# EAGLE design mcu_battery (EAGLE 9.5.2)
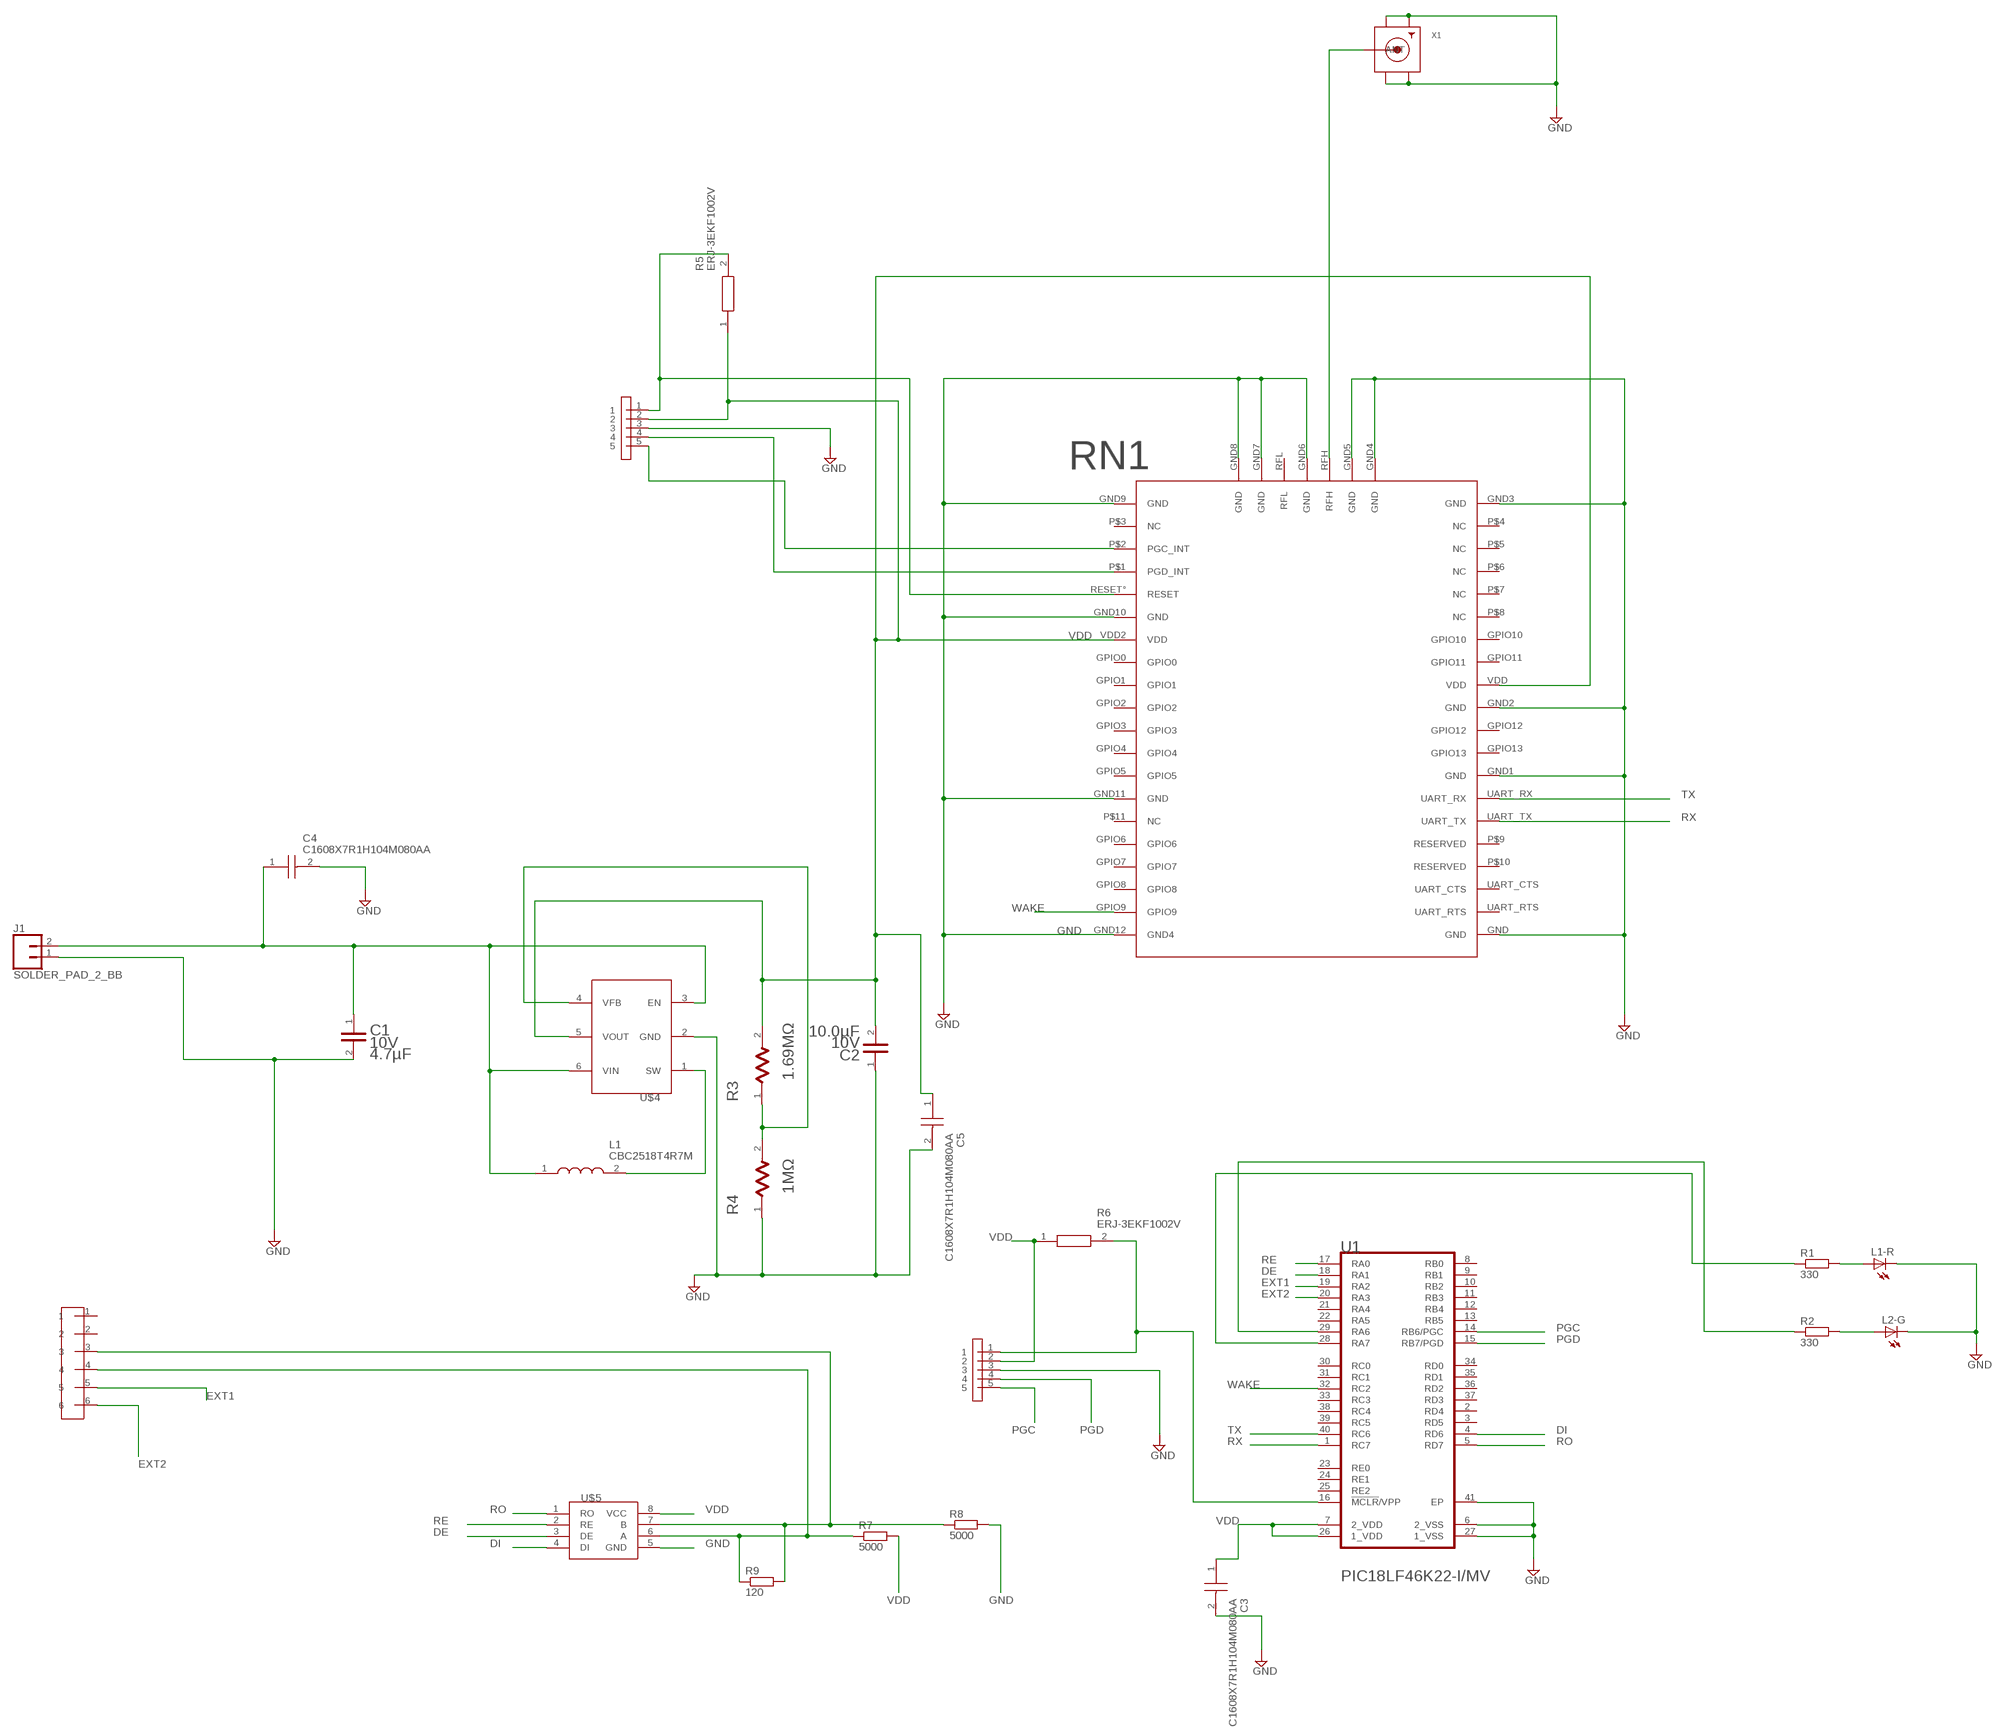
[diagram p0: schematic, sheet 1]

## Parts
C1  KEMET_C0603C475K8PACTUKEMET_C0603C475K8PACTU_0_0  [KEMET_C0603C475K8PACTU_0]
C2  TDK_C1608X5R1A106M080ACTDK_C1608X5R1A106M080AC_0_0  [TDK_C1608X5R1A106M080AC_0]
C3  C1608X7R1H104M080AA  [CAPC1608X80N]
C4  C1608X7R1H104M080AA  [CAPC1608X80N]
C5  C1608X7R1H104M080AA  [CAPC1608X80N]
J1  SOLDER_PAD_2_BB  [SOLDER_PAD_2]
L1  CBC2518T4R7M  [INDC2518X200N]
L1-R  LEDCHIP-LED0603  [CHIP-LED0603]
L2-G  LEDCHIP-LED0603  [CHIP-LED0603]
R1  330  R-EU_R0603  [R0603]
R2  330  R-EU_R0603  [R0603]
R3  VISHAY_CRCW06031M69FKEAVISHAY_CRCW06031M69FKEA_0_1  [VISHAY_CRCW06031M69FKEA_1]
R4  STACKPOLE_RMCF0603FT1M00STACKPOLE_RMCF0603FT1M00_0_1  [STACKPOLE_RMCF0603FT1M00_1]
R5  ERJ-3EKF1002V  [RESC1608X55N]
R6  ERJ-3EKF1002V  [RESC1608X55N]
R7  5000  R-EU_R0805  [R0805]
R8  5000  R-EU_R0805  [R0805]
R9  120  R-EU_R0805  [R0805]
RN1  NEW_RN2483  [NEW_RN2483]
U1  MICROCHIP_PIC18LF46K22-I-MVMICROCHIP_PIC18LF46K22-I-MV_0_1  [MICROCHIP_PIC18LF46K22-I-MV_1]
U$1  CONNECTOR62  [CONNECTOR6]
U$2  ICSP52  [ICSP]
U$3  ICSP52  [ICSP]
U$4  MCP16252  [MCP16252]
U$5  AMD3485E  [AMD3485E]
X1  SMACONNECTOR_EDGE  [SMA_EDGELAUNCH]

## Nets
DE: U1.18(RA1) U$5.3(DE)
DI: U1.4(RD6) U$5.4(DI)
EXT1: U1.19(RA2) U$1.5
EXT2: U1.20(RA3) U$1.6
GND: C1.2 C2.1 C3.2 C4.2 C5.2 J1.1 L1-R.C L2-G.C R4.1 R8.2 RN1.GND RN1.GND1(GND) RN1.GND2(GND) RN1.GND3(GND) RN1.GND4(GND) RN1.GND5(GND) RN1.GND6(GND) RN1.GND7(GND) RN1.GND8(GND) RN1.GND9(GND) RN1.GND10(GND) RN1.GND11(GND) RN1.GND12(GND4) U1.6(2_VSS) U1.27(1_VSS) U1.41(EP) U$2.3 U$3.3 U$4.2(GND) U$5.5(GND) X1.GND@1(GND4) X1.GND@2(GND3) X1.GND@3(GND2) X1.GND@4(GND1)
MCLR: R6.2 U1.16(!MCLR!/VPP) U$2.1
N$1: R2.1 U1.29(RA6)
N$2: L2-G.A R2.2
N$3: R1.1 U1.28(RA7)
N$4: C1.1 C4.1 J1.2 L1.1 U$4.3(EN) U$4.6(VIN)
N$5: L1-R.A R1.2
N$6: L1.2 U$4.1(SW)
N$7: R5.2 RN1.RESET°(RESET) U$3.1
N$8: RN1.RFH X1.P(ANT)
N$9: R3.1 R4.2 U$4.4(VFB)
N$10: RN1.P$2(PGC_INT) U$3.5
N$12: RN1.P$1(PGD_INT) U$3.4
N$13: R8.1 R9.2 U$1.3 U$5.7(B)
N$14: R7.1 R9.1 U$1.4 U$5.6(A)
PGC: U1.14(RB6/PGC) U$2.5
PGD: U1.15(RB7/PGD) U$2.4
RE: U1.17(RA0) U$5.2(RE)
RO: U1.5(RD7) U$5.1(RO)
RX: RN1.UART_TX U1.1(RC7)
TX: RN1.UART_RX U1.40(RC6)
VDD: C2.2 C3.1 C5.1 R3.2 R5.1 R6.1 R7.2 RN1.VDD RN1.VDD2(VDD) U1.7(2_VDD) U1.26(1_VDD) U$2.2 U$3.2 U$4.5(VOUT) U$5.8(VCC)
WAKE: RN1.GPIO9 U1.32(RC2)
Unconnected: RN1.GPIO0 RN1.GPIO1 RN1.GPIO2 RN1.GPIO3 RN1.GPIO4 RN1.GPIO5 RN1.GPIO6 RN1.GPIO7 RN1.GPIO8 RN1.GPIO10 RN1.GPIO11 RN1.GPIO12 RN1.GPIO13 RN1.P$3(NC) RN1.P$4(NC) RN1.P$5(NC) RN1.P$6(NC) RN1.P$7(NC) RN1.P$8(NC) RN1.P$9(RESERVED) RN1.P$10(RESERVED) RN1.P$11(NC) RN1.RFL RN1.UART_CTS RN1.UART_RTS U1.2(RD4) U1.3(RD5) U1.8(RB0) U1.9(RB1) U1.10(RB2) U1.11(RB3) U1.12(RB4) U1.13(RB5) U1.21(RA4) U1.22(RA5) U1.23(RE0) U1.24(RE1) U1.25(RE2) U1.30(RC0) U1.31(RC1) U1.33(RC3) U1.34(RD0) U1.35(RD1) U1.36(RD2) U1.37(RD3) U1.38(RC4) U1.39(RC5) U$1.1 U$1.2

## Library data of the parts
C1 = Kemet - C0603C475K8PACTU:KEMET_C0603C475K8PACTU: CAP CER 4.7UF 10V X5R 0603; CAPACITANCE: 4.7µF; CENTROID_NOT_SPECIFIED: No; DATASHEET: https://search.kemet.com/component-edge/download/datasheet/C0603C475K8PACTU.pdf; DIGIKEY_DESCRIPTION: CAP CER 4.7UF 10V X5R 0603; DIGIKEY_PART_NUMBER: 399-5503-1-ND; LEAD_FREE: yes; MF: Kemet; MFG_PACKAGE_IDENT: C0603; MOUSER_DESCRIPTION: Multilayer Ceramic Capacitors MLCC - SMD/SMT 10volts 4.7uF 10% X5R; MOUSER_PART_NUMBER: 80-C0603C475K8P; MPN: C0603C475K8PACTU; PACKAGE: 0603; PREFIX: C; ROHS: yes; TEMPERATURE_RANGE_HIGH: +85°C; TEMPERATURE_RANGE_LOW: -55°C; VOLTAGE: 10V
C2 = TDK - C1608X5R1A106M080AC:TDK_C1608X5R1A106M080AC: 10 uF Ceramic Capacitor; CAPACITANCE: 10.0µF; CAPACITANCE_TOLERANCE: ±20%; CENTROID_NOT_SPECIFIED: No; DATASHEET: https://product.tdk.com/info/en/catalog/datasheets/mlcc_commercial_general_en.pdf; DIELECTRIC_CHARACTERISTIC: X5R; DIELECTRIC_MATERIAL: Ceramic Multilayer; DIGIKEY_DESCRIPTION: CAP CER 10UF 10V X5R 0603; DIGIKEY_PART_NUMBER: 445-6853-1-ND; IMPORTED_FROM: octopart; IPC_LAND_PATTERN_NAME: CAPC16080X80; LEAD_FREE: yes; MF: TDK; MOUSER_PART_NUMBER: 810-C1608X5R1A106M; MPN: C1608X5R1A106M080AC; NUM_PINS: 2; OCTOPART_PART_NUMBER: f5f73d6e4e4d2a30; PACKAGE: 0603; PREFIX: C; ROHS: yes; SIZE_LENGTH: 1.6 mm; SIZE_THICKNESS: 800 um; SIZE_WIDTH: 800 um; TEMPERATURE_RANGE_HIGH: +85°C; TEMPERATURE_RANGE_LOW: -55°C; VOLTAGE: 10V; VOLTAGE_RATING_DC: 10 V
C3-C5 = C1608X7R1H104M080AA:C1608X7R1H104M080AA: TDK 0603 C 100nF Ceramic Multilayer Capacitor, 50 V dc, +125C, X7R Dielectric, +/-20% Source: Datasheet <https://product.tdk.com/info/en/catalog/datasheets/mlcc_commercial_midvoltage_en.pdf>; ARROW_PART_NUMBER: C1608X7R1H104M080AA; ARROW_PRICE-STOCK: https://www.arrow.com/en/products/c1608x7r1h104m080aa/tdk; DESCRIPTION: TDK 0603 C 100nF Ceramic Multilayer Capacitor, 50 V dc, +125C, X7R Dielectric, +/-20%; HEIGHT: 0.8mm; MANUFACTURER_NAME: TDK; MANUFACTURER_PART_NUMBER: C1608X7R1H104M080AA; MOUSER_PART_NUMBER: 810-C1608X7R1H104M; MOUSER_PRICE-STOCK: https://www.mouser.co.uk/ProductDetail/TDK/C1608X7R1H104M080AA?qs=dfay7wIA1uEL2BE%2FFUaTdg%3D%3D
J1 = SparkFun-Connectors:SOLDER_PAD_2_BB: Solder Pad for LuMini Rings
L1 = CBC2518T4R7M:CBC2518T4R7M: Fixed Inductors INDCTR HI CUR WND 1007 4.7uH 20% Source: Datasheet <http://ds.yuden.co.jp/TYCOMPAS/ut/detail.do?productNo=CBC2518T4R7M&dataUnit=M.pdf>; ARROW_PART_NUMBER: CBC2518T4R7M; DESCRIPTION: Fixed Inductors INDCTR HI CUR WND 1007 4.7uH 20%; HEIGHT: 2mm; MANUFACTURER_NAME: TAIYO YUDEN; MANUFACTURER_PART_NUMBER: CBC2518T4R7M; MOUSER_PART_NUMBER: 963-CBC2518T4R7M; MOUSER_PRICE-STOCK: https://www.mouser.com/Search/Refine.aspx?Keyword=963-CBC2518T4R7M
L1-R L2-G = adafruit:LED: LED OSRAM: - CHIPLED LG R971, LG N971, LY N971, LG Q971, LY Q971, LO R971, LY R971 LH N974, LH R974 LS Q976, LO Q976, LY Q976 LO Q996 - Hyper CHIPLED LW Q18S LB Q993, LB Q99A, LB R99A - SideLED LS A670, LO A670, LY A670, LG A670, LP A670 LB A673, LV A673, LT A673, LW A673 LH A674 LY A675 LS A676, LA A676, LO A676, LY A676, LW A676 LS A679, LY A679, LG A679 - Hyper Micro SIDELED® LS Y876, LA Y876, LO Y876, LY Y876 LT Y87S - SmartLED LW L88C, LW L88S LB L89C, LB L89S, LG L890 LS L89K, LO L89K, LY L89K LS L896, LA L896, LO L896, LY L896 - TOPLED LS T670, LO T670, LY T670, LG T670, LP T670 LSG T670, LSP T670, LSY T670, LOP T670, LYG T670 LG T671, LOG T671, LSG T671 LB T673, LV T673, LT T673, LW T673 LH T674 LS T676, LA T676, LO T676, LY T676, LB T676, LH T676, LSB T676, LW T676 LB T67C, LV T67C, LT T67C, LS T67K, LO T67K, LY T67K, LW E67C LS E67B, LA E67B, LO E67B, LY E67B, LB E67C, LV E67C, LT E67C LW T67C LS T679, LY T679, LG T679 LS T770, LO T770, LY T770, LG T770, LP T770 LB T773, LV T773, LT T773, LW T773 LH T774 LS E675, LA E675, LY E675, LS T675 LS T776, LA T776, LO T776, LY T776, LB T776 LHGB T686 LT T68C, LB T68C - Hyper Mini TOPLED® LB M676 - Mini TOPLED Santana® LG M470 LS M47K, LO M47K, LY M47K Source: http://www.osram.convergy.de/
R1 R2 R7-R9 = rcl:R-EU_: RESISTOR, European symbol; SPICEPREFIX: R
R3 = Vishay - CRCW06031M69FKEA:VISHAY_CRCW06031M69FKEA: RES Thick Film SMD 1.69MΩ 1% 1/10W 0603 100ppm/K; APPROVED_ALTERNATE_PART_NUMBER: 541-1.00HHCT-ND; CENTROID_NOT_SPECIFIED: No; COMPOSITION: Thick Film; DATASHEET: https://www.vishay.com/docs/20035/dcrcwe3.pdf; DEVICE_CLASS_L1: Passive Components; DEVICE_CLASS_L2: Resistors; DEVICE_CLASS_L3: Chip SMD Resistors; DIGIKEY_DESCRIPTION: RES SMD 1.69M OHM 1% 1/10W 0603; DIGIKEY_PART_NUMBER: 541-1.69MHTR-ND; FOOTPRINT_PARAMETERS_0: {"fp_type":"chip_res","params":{"L":{"nom":1550000,"long name":"Length","min":1500000,"max":1650000,"short name":"L","type":"measurement"},"W":{"nom":850000,"long name":"Width","min":750000,"max":950000,"short name":"W","type":"measurement"},"t":{"nom":450000,"long name":"Height","min":400000,"max":500000,"short name":"t","type":"measurement"},"b":{"nom":300000,"long name":"Terminal width","min":100000,"max":500000,"short name":"b","type":"measurement"},"P":{"default":"false","long name":"Polarized","type":"multichoice","short name":"P"},"offset x":{"nom":0,"long name":"X Center offset","min":null,"max":null,"short name":"offset x","type":"measurement"},"offset y":{"nom":0,"long name":"Y Center offset","min":null,"max":null,"short name":"offset y","type":"measurement"},"LS":{"long name":"Land shape","type":"fixed","short name":"LS","value":"Rectangle"},"solder toe":{"nom":550000,"long name":"Solder fillet (toe)","min":null,"max":null,"short name":"solder toe","type":"fixedmeasurement"},"solder heel":{"nom":-50000,"long name":"Solder fillet (heel)","min":null,"max":null,"short name":"solder heel","type":"fixedmeasurement"},"solder side":{"nom":50000,"long name":"Solder fillet (side)","min":null,"max":null,"short name":"solder side","type":"fixedmeasurement"},"courtyard":{"nom":500000,"long name":"Courtyard","min":null,"max":null,"short name":"courtyard","type":"fixedmeasurement"},"SF":{"default":"A (>= 1608 metric)","long name":"Packing level","type":"multichoiceparent","short name":"SF","help":"http://support.upverter.com/customer/portal/articles/978783-what-is-a-footprint-packing-level","children":["solder toe","solder heel","solder side","courtyard"]}}}; FOOTPRINT_PARAMETERS_1: {"fp_type":"chip_res","params":{"L":{"nom":1550000,"long name":"Length","min":1500000,"max":1650000,"short name":"L","type":"measurement"},"W":{"nom":850000,"long name":"Width","min":750000,"max":950000,"short name":"W","type":"measurement"},"t":{"nom":450000,"long name":"Height","min":400000,"max":500000,"short name":"t","type":"measurement"},"b":{"nom":300000,"long name":"Terminal width","min":100000,"max":500000,"short name":"b","type":"measurement"},"P":{"default":"false","long name":"Polarized","type":"multichoice","short name":"P"},"offset x":{"nom":0,"long name":"X Center offset","min":null,"max":null,"short name":"offset x","type":"measurement"},"offset y":{"nom":0,"long name":"Y Center offset","min":null,"max":null,"short name":"offset y","type":"measurement"},"LS":{"long name":"Land shape","type":"fixed","short name":"LS","value":"Rectangle"},"solder toe":{"nom":350000,"long name":"Solder fillet (toe)","min":null,"max":null,"short name":"solder toe","type":"fixedmeasurement"},"solder heel":{"nom":-50000,"long name":"Solder fillet (heel)","min":null,"max":null,"short name":"solder heel","type":"fixedmeasurement"},"solder side":{"nom":0,"long name":"Solder fillet (side)","min":null,"max":null,"short name":"solder side","type":"fixedmeasurement"},"courtyard":{"nom":250000,"long name":"Courtyard","min":null,"max":null,"short name":"courtyard","type":"fixedmeasurement"},"SF":{"default":"B (>= 1608 metric)","long name":"Packing level","type":"multichoiceparent","short name":"SF","help":"http://support.upverter.com/customer/portal/articles/978783-what-is-a-footprint-packing-level","children":["solder toe","solder heel","solder side","courtyard"]}}}; FOOTPRINT_PARAMETERS_2: {"fp_type":"chip_res","params":{"L":{"nom":1550000,"long name":"Length","min":1500000,"max":1650000,"short name":"L","type":"measurement"},"W":{"nom":850000,"long name":"Width","min":750000,"max":950000,"short name":"W","type":"measurement"},"t":{"nom":450000,"long name":"Height","min":400000,"max":500000,"short name":"t","type":"measurement"},"b":{"nom":300000,"long name":"Terminal width","min":100000,"max":500000,"short name":"b","type":"measurement"},"P":{"default":"false","long name":"Polarized","type":"multichoice","short name":"P"},"offset x":{"nom":0,"long name":"X Center offset","min":null,"max":null,"short name":"offset x","type":"measurement"},"offset y":{"nom":0,"long name":"Y Center offset","min":null,"max":null,"short name":"offset y","type":"measurement"},"LS":{"long name":"Land shape","type":"fixed","short name":"LS","value":"Rectangle"},"solder toe":{"nom":150000,"long name":"Solder fillet (toe)","min":null,"max":null,"short name":"solder toe","type":"fixedmeasurement"},"solder heel":{"nom":-50000,"long name":"Solder fillet (heel)","min":null,"max":null,"short name":"solder heel","type":"fixedmeasurement"},"solder side":{"nom":-50000,"long name":"Solder fillet (side)","min":null,"max":null,"short name":"solder side","type":"fixedmeasurement"},"courtyard":{"nom":100000,"long name":"Courtyard","min":null,"max":null,"short name":"courtyard","type":"fixedmeasurement"},"SF":{"default":"C (>= 1608 metric)","long name":"Packing level","type":"multichoiceparent","short name":"SF","help":"http://support.upverter.com/customer/portal/articles/978783-what-is-a-footprint-packing-level","children":["solder toe","solder heel","solder side","courtyard"]}}}; FOOTPRINT_VARIANT_NAME_0: IPC_A; FOOTPRINT_VARIANT_NAME_1: IPC_B; FOOTPRINT_VARIANT_NAME_2: IPC_C; FOOTPRINT_VARIANT_NAME_3: Recommended_Land_Pattern; HEIGHT: 0.5mm; IPC_LAND_PATTERN_NAME: RESC15585X45; LEAD_FREE: yes; MF: Vishay; MFG_PACKAGE_IDENT: CRCW0603; MFG_PACKAGE_IDENT_DATE: 0; MFG_PACKAGE_IDENT_REV: 0; MOUSER_DESCRIPTION: Thick Film Resistors - SMD 1/10watt 1.69Mohms 1%; MOUSER_PART_NUMBER: 71-CRCW06031M69FKEA; MPN: CRCW06031M69FKEA; PACKAGE: 0603 (1608 Metric); POWER: 100mW; POWER_RATING: 0.1W; PREFIX: R; RESISTANCE: 1.69MΩ; ROHS: yes; SERIES: CRCW; STANDOFF_HEIGHT: 0mm; TEMPERATURE_COEFFICIENT: 100ppm/K; TEMPERATURE_RANGE_HIGH: +155°C; TEMPERATURE_RANGE_LOW: -55°C; TOLERANCE: 1%; VERIFICATION_VERSION: 0.0.0.1; VOLTAGE: 75V; VOLTAGE_RATING: 75V
R4 = Stackpole - RMCF0603FT1M00:STACKPOLE_RMCF0603FT1M00: RES Thick Film SMD 1MΩ 1% 1/10W 0603 100ppm/°C; APPROVED_ALTERNATE_PART_NUMBER: 541-1.00HHCT-ND; CENTROID_NOT_SPECIFIED: No; COMPOSITION: Thick Film; DATASHEET: https://www.seielect.com/Catalog/SEI-RMCF_RMCP.pdf; DEVICE_CLASS_L1: Passive Components; DEVICE_CLASS_L2: Resistors; DEVICE_CLASS_L3: Chip SMD Resistors; DIGIKEY_DESCRIPTION: RES TF 1/10W 1M OHM 1% 0603; DIGIKEY_PART_NUMBER: RMCF0603FT1M00-ND; FOOTPRINT_PARAMETERS_0: {"fp_type":"chip_res","params":{"L":{"nom":1550000,"long name":"Length","min":1500000,"max":1650000,"short name":"L","type":"measurement"},"W":{"nom":850000,"long name":"Width","min":750000,"max":950000,"short name":"W","type":"measurement"},"t":{"nom":450000,"long name":"Height","min":400000,"max":500000,"short name":"t","type":"measurement"},"b":{"nom":300000,"long name":"Terminal width","min":100000,"max":500000,"short name":"b","type":"measurement"},"P":{"default":"false","long name":"Polarized","type":"multichoice","short name":"P"},"offset x":{"nom":0,"long name":"X Center offset","min":null,"max":null,"short name":"offset x","type":"measurement"},"offset y":{"nom":0,"long name":"Y Center offset","min":null,"max":null,"short name":"offset y","type":"measurement"},"LS":{"long name":"Land shape","type":"fixed","short name":"LS","value":"Rectangle"},"solder toe":{"nom":550000,"long name":"Solder fillet (toe)","min":null,"max":null,"short name":"solder toe","type":"fixedmeasurement"},"solder heel":{"nom":-50000,"long name":"Solder fillet (heel)","min":null,"max":null,"short name":"solder heel","type":"fixedmeasurement"},"solder side":{"nom":50000,"long name":"Solder fillet (side)","min":null,"max":null,"short name":"solder side","type":"fixedmeasurement"},"courtyard":{"nom":500000,"long name":"Courtyard","min":null,"max":null,"short name":"courtyard","type":"fixedmeasurement"},"SF":{"default":"A (>= 1608 metric)","long name":"Packing level","type":"multichoiceparent","short name":"SF","help":"http://support.upverter.com/customer/portal/articles/978783-what-is-a-footprint-packing-level","children":["solder toe","solder heel","solder side","courtyard"]}}}; FOOTPRINT_PARAMETERS_1: {"fp_type":"chip_res","params":{"L":{"nom":1550000,"long name":"Length","min":1500000,"max":1650000,"short name":"L","type":"measurement"},"W":{"nom":850000,"long name":"Width","min":750000,"max":950000,"short name":"W","type":"measurement"},"t":{"nom":450000,"long name":"Height","min":400000,"max":500000,"short name":"t","type":"measurement"},"b":{"nom":300000,"long name":"Terminal width","min":100000,"max":500000,"short name":"b","type":"measurement"},"P":{"default":"false","long name":"Polarized","type":"multichoice","short name":"P"},"offset x":{"nom":0,"long name":"X Center offset","min":null,"max":null,"short name":"offset x","type":"measurement"},"offset y":{"nom":0,"long name":"Y Center offset","min":null,"max":null,"short name":"offset y","type":"measurement"},"LS":{"long name":"Land shape","type":"fixed","short name":"LS","value":"Rectangle"},"solder toe":{"nom":350000,"long name":"Solder fillet (toe)","min":null,"max":null,"short name":"solder toe","type":"fixedmeasurement"},"solder heel":{"nom":-50000,"long name":"Solder fillet (heel)","min":null,"max":null,"short name":"solder heel","type":"fixedmeasurement"},"solder side":{"nom":0,"long name":"Solder fillet (side)","min":null,"max":null,"short name":"solder side","type":"fixedmeasurement"},"courtyard":{"nom":250000,"long name":"Courtyard","min":null,"max":null,"short name":"courtyard","type":"fixedmeasurement"},"SF":{"default":"B (>= 1608 metric)","long name":"Packing level","type":"multichoiceparent","short name":"SF","help":"http://support.upverter.com/customer/portal/articles/978783-what-is-a-footprint-packing-level","children":["solder toe","solder heel","solder side","courtyard"]}}}; FOOTPRINT_PARAMETERS_2: {"fp_type":"chip_res","params":{"L":{"nom":1550000,"long name":"Length","min":1500000,"max":1650000,"short name":"L","type":"measurement"},"W":{"nom":850000,"long name":"Width","min":750000,"max":950000,"short name":"W","type":"measurement"},"t":{"nom":450000,"long name":"Height","min":400000,"max":500000,"short name":"t","type":"measurement"},"b":{"nom":300000,"long name":"Terminal width","min":100000,"max":500000,"short name":"b","type":"measurement"},"P":{"default":"false","long name":"Polarized","type":"multichoice","short name":"P"},"offset x":{"nom":0,"long name":"X Center offset","min":null,"max":null,"short name":"offset x","type":"measurement"},"offset y":{"nom":0,"long name":"Y Center offset","min":null,"max":null,"short name":"offset y","type":"measurement"},"LS":{"long name":"Land shape","type":"fixed","short name":"LS","value":"Rectangle"},"solder toe":{"nom":150000,"long name":"Solder fillet (toe)","min":null,"max":null,"short name":"solder toe","type":"fixedmeasurement"},"solder heel":{"nom":-50000,"long name":"Solder fillet (heel)","min":null,"max":null,"short name":"solder heel","type":"fixedmeasurement"},"solder side":{"nom":-50000,"long name":"Solder fillet (side)","min":null,"max":null,"short name":"solder side","type":"fixedmeasurement"},"courtyard":{"nom":100000,"long name":"Courtyard","min":null,"max":null,"short name":"courtyard","type":"fixedmeasurement"},"SF":{"default":"C (>= 1608 metric)","long name":"Packing level","type":"multichoiceparent","short name":"SF","help":"http://support.upverter.com/customer/portal/articles/978783-what-is-a-footprint-packing-level","children":["solder toe","solder heel","solder side","courtyard"]}}}; FOOTPRINT_VARIANT_NAME_0: IPC_A; FOOTPRINT_VARIANT_NAME_1: IPC_B; FOOTPRINT_VARIANT_NAME_2: IPC_C; FOOTPRINT_VARIANT_NAME_3: Recommended_Land_Pattern; HEIGHT: 0.5mm; IPC_LAND_PATTERN_NAME: RESC15585X45; LEAD_FREE: yes; MF: Stackpole; MFG_PACKAGE_IDENT: RMCF0603; MFG_PACKAGE_IDENT_DATE: 0; MFG_PACKAGE_IDENT_REV: 0; MPN: RMCF0603FT1M00; PACKAGE: 0603 (1608 Metric); POWER: 100mW; POWER_RATING: 0.1W; PREFIX: R; RESISTANCE: 1MΩ; ROHS: yes; SERIES: RMCF; STANDOFF_HEIGHT: 0mm; TEMPERATURE_COEFFICIENT: 100ppm/°C; TEMPERATURE_RANGE_HIGH: +155°C; TEMPERATURE_RANGE_LOW: -55°C; TOLERANCE: 1%; VERIFICATION_VERSION: 0.0.0.1; VOLTAGE: 75V; VOLTAGE_RATING: 75V
R5 R6 = ERJ-3EKF1002V:ERJ-3EKF1002V: Thick Film Resistors - SMD 0603 10Kohms 1% AEC-Q200 Source: Datasheet <http://industrial.panasonic.com/cdbs/www-data/pdf/RDA0000/AOA0000C86.pdf>; ARROW_PART_NUMBER: ERJ-3EKF1002V; ARROW_PRICE-STOCK: https://www.arrow.com/en/products/erj-3ekf1002v/panasonic; DESCRIPTION: Thick Film Resistors - SMD 0603 10Kohms 1% AEC-Q200; HEIGHT: 0.55mm; MANUFACTURER_NAME: Panasonic; MANUFACTURER_PART_NUMBER: ERJ-3EKF1002V; MOUSER_PART_NUMBER: 667-ERJ-3EKF1002V; MOUSER_PRICE-STOCK: https://www.mouser.co.uk/ProductDetail/Panasonic/ERJ-3EKF1002V?qs=H7k1u0Mp9JSrGPQ5%2F5COuw%3D%3D
RN1 = tobias:NEW_RN2483
U1 = MV:MICROCHIP_PIC18LF46K22-I-MV: MCHP-PIC18F4XK22-UQFN-40; CIIVA_IDS: 1156885; COMPONENT_LINK_2_DESCRIPTION: Package Specification; COMPONENT_LINK_2_URL: http://www.microchip.com/stellent/groups/techpub_sg/documents/packagingspec/en012702.pdf; COMPONENT_LINK_3_DESCRIPTION: URL Link1; COMPONENT_LINK_3_URL: Product URL:http://www.microchip.com/datasheet/PIC18F46K22; DATASHEET: http://ww1.microchip.com/downloads/en/DeviceDoc/41412F.pdf; DATASHEET_VERSION: Rev. F; DIGITAL_COMMUNICATION: 2-A/E/USART, 2-MSSP(SPI/I2C); EEPROM_DATA_MEMORY_BYTES: 1024; FOOTPRINT_VARIANT_NAME_0: Level C; FOOTPRINT_VARIANT_NAME_1: Level B; FOOTPRINT_VARIANT_NAME_2: Level A; IMPORTED: yes; IMPORTED_FROM: vault; IMPORT_TS: 1521862508; INTERNAL_OSCILLATOR: 16 MHz, 31 kHz; IO_PINS: 35; MAX_CPU_SPEED_MHZ: 16; MEMORY_TYPE: Flash; MF: Microchip; MOUNTING_TECHNOLOGY: Surface Mount; MPN: PIC18LF46K22-I/MV; OF_AD_CHANNELS: 28; OPERATION_VOLTAGE_RANGE: 1.8V - 3.6V; PACKAGE: UQFN-MV40; PACKAGE_DESCRIPTION: 40-Lead Plastic Ultra Thin Quad Flat, No Lead Package, Body 5 x 5 mm, Pitch 0.4 mm; PACKAGE_VERSION: C04-156A, 04/2013; PACKING: TUBE; PIN_0_0_13_INSIDE_EDGE: clock; PREFIX: U; PROGRAM_MEMORY_KBYTES: 64; PROGRAM_MEMORY_KWORDS: 32; RAM: 3896; RELEASE_DATE: 1370054166; TIMERS: 3 - 8-bit, 4 - 16-bit; VAULT_GUID: 4AD4499F-4258-456F-8BC1-D82EC74C6FCE; VAULT_REVISION: 1F45D5E2-C531-4F36-B47A-F05F4A728A22
U$1 = conn4:CONNECTOR62
U$2 U$3 = conn4:ICSP52
U$4 = my_library:MCP16252
U$5 = AMD3485E:AMD3485E
X1 = adafruit:SMACONNECTOR: SMA Connector 90° DIP SMA Connector, 50 Ohm (4UConnector: 07259)

## Net classes
0 default: width 0.203 mm, drill 0.508 mm, clearance 0.203 mm

## Board
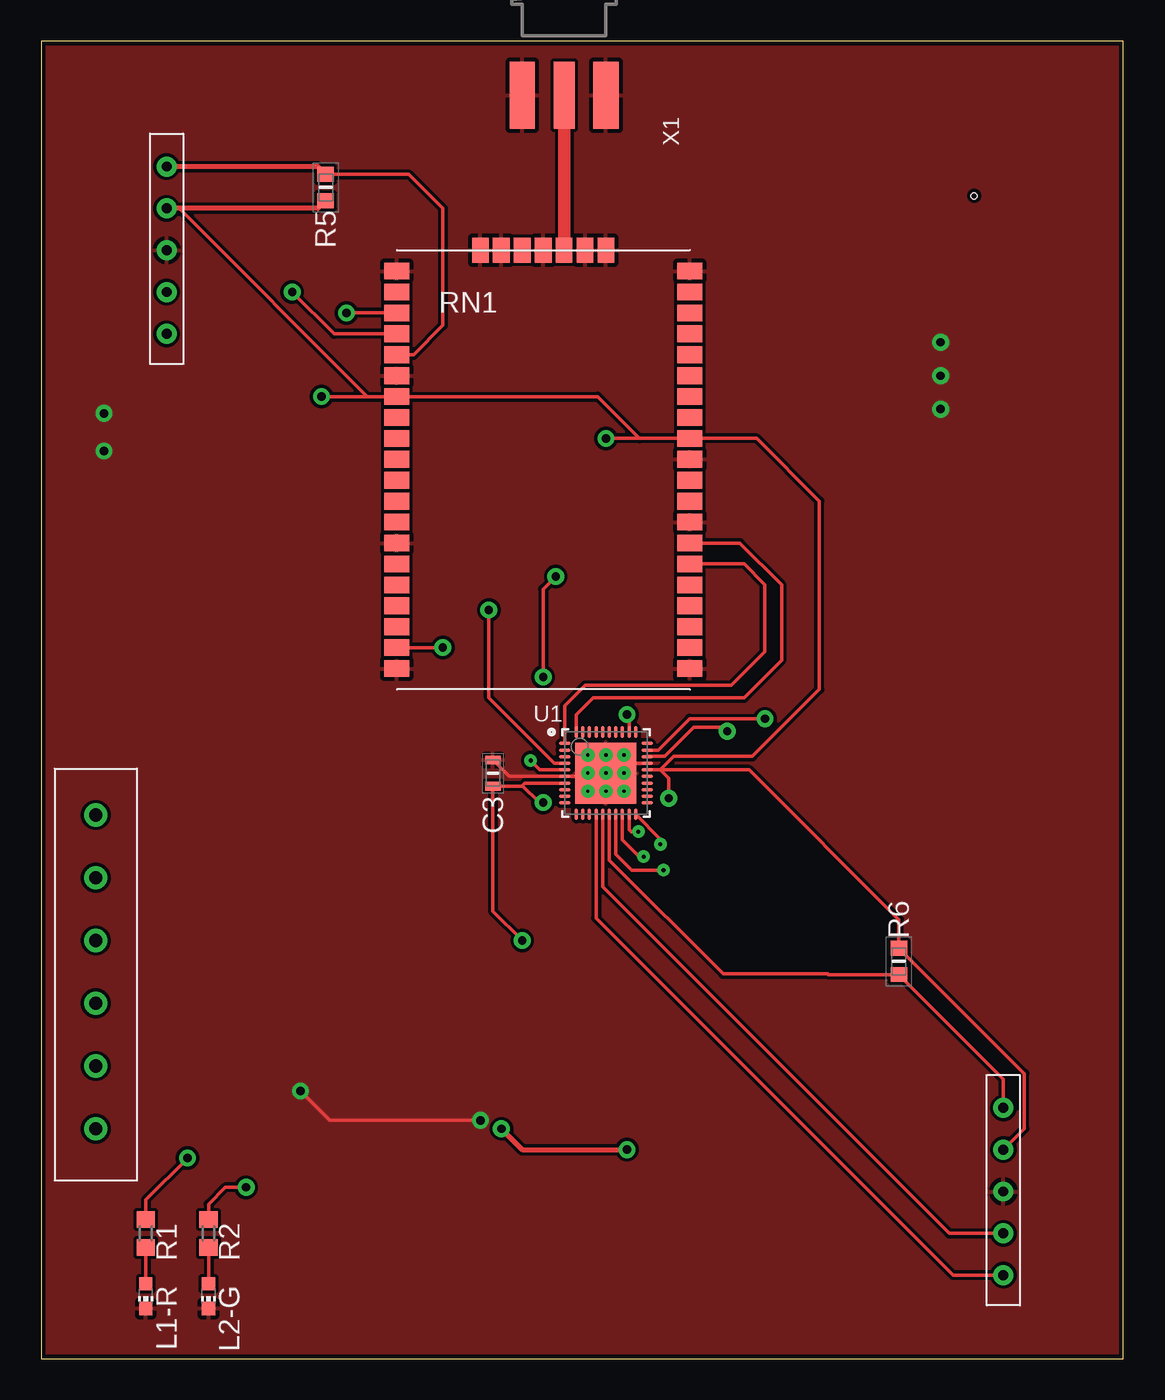
[diagram p1: board, top side]
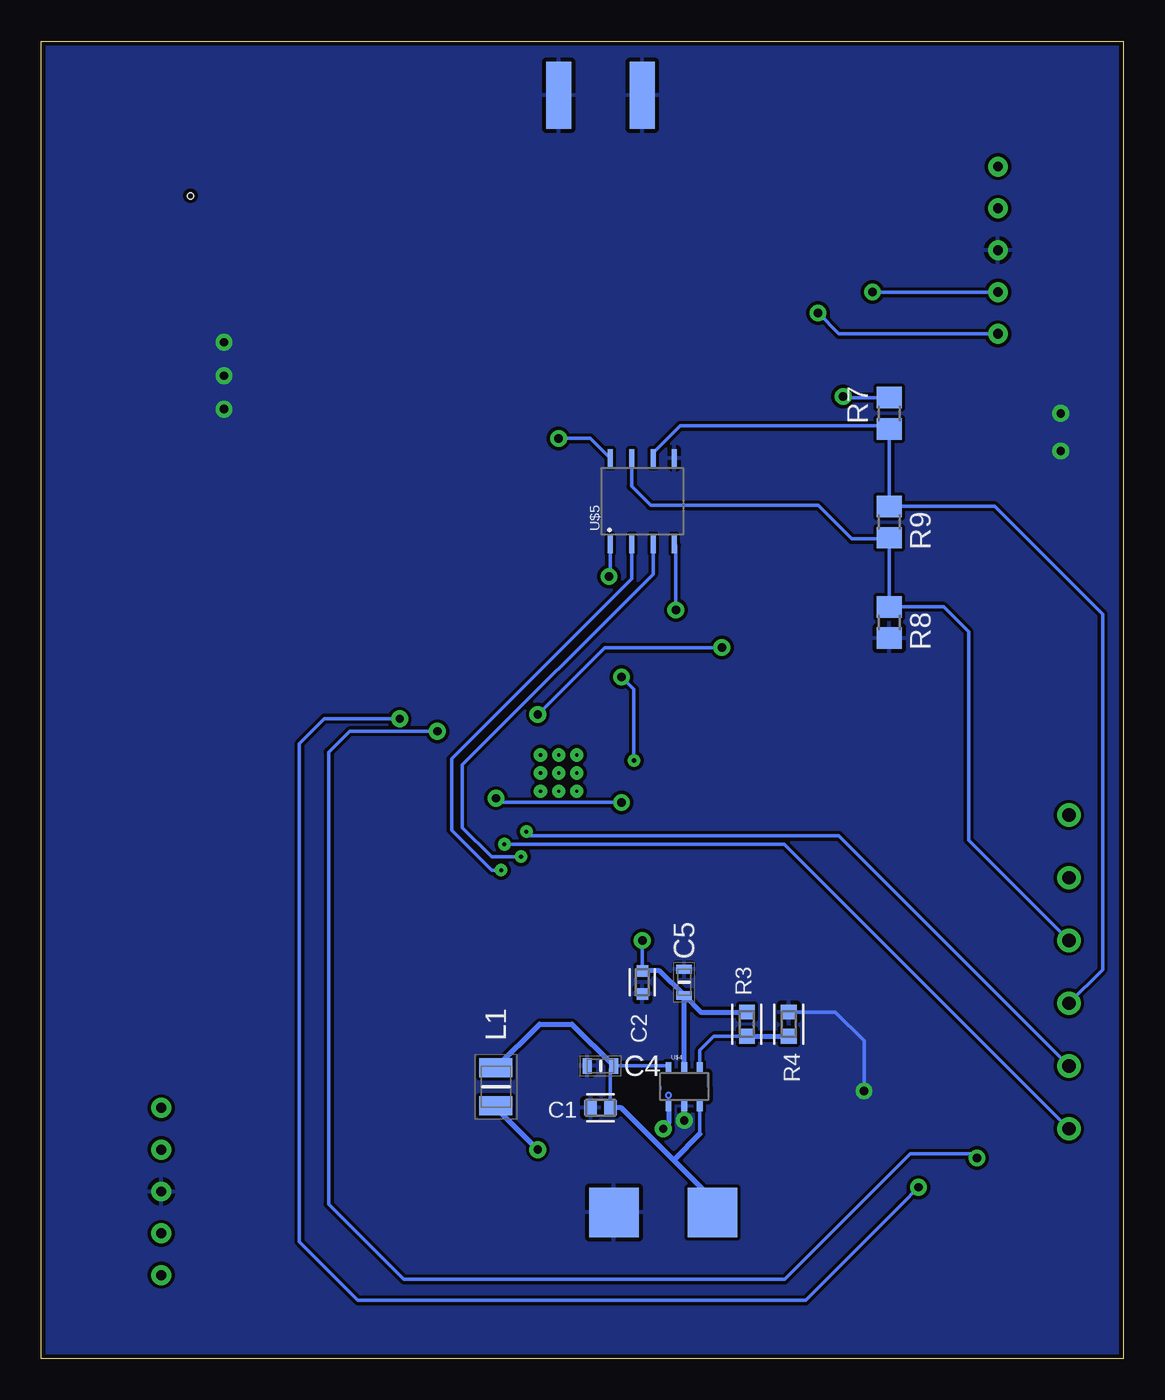
[diagram p2: board, bottom side, seen from below]

Size 65.71 x 80 mm. Coordinates in mm from the lower left corner, seen from the top.
Outline: 0,0 65.71,0 65.71,80 0,80 0,0
Copper layers (1*16): Top 0.035mm / dielectric 1.5mm / Bottom 0.035mm
Design rules "SparkFun": minimum track width 8mil, minimum drill 20mil, track to track 8mil, track to pad 8mil, pad to pad 8mil, via to via 8mil, smd to smd 8mil, copper to edge 10mil, drill to drill 8mil, minimum pad ring 12mil, minimum via ring 10mil, stop-mask expansion 4mil, vias tented up to drill 25mil, thermal gap 10mil
Holes 0.35 mm at 56.64,70.61

### Footprints (pad centres in the part's own frame; a part is rotated, then mirrored left to right if it is on the bottom)
KEMET_C0603C475K8PACTU_0 = smd 0.75 x 0.9: 1 -0.6,0; 2 0.6,0
TDK_C1608X5R1A106M080AC_0 = smd 0.7 x 0.7: 1 -0.7,0; 2 0.7,0
CAPC1608X80N = smd 0.54 x 0.94: 1 -0.8,0; 2 0.8,0
SOLDER_PAD_2 = smd 3 x 3: 1 -3,0; 2 3,0
INDC2518X200N = smd 1.15 x 2: 1 -1.15,0; 2 1.15,0
CHIP-LED0603 = smd 0.8 x 0.8: A 0,-0.75; C 0,0.75
R0603 = smd 1 x 1.1: 1 -0.85,0; 2 0.85,0
VISHAY_CRCW06031M69FKEA_1 = smd 0.891 x 0.962: 1 -0.737,0; 2 0.737,0
STACKPOLE_RMCF0603FT1M00_1 = smd 0.891 x 0.962: 1 -0.737,0; 2 0.737,0
RESC1608X55N = smd 0.9 x 1: 1 -0.8,0; 2 0.8,0
R0805 = smd 1.3 x 1.5: 1 -0.95,0; 2 0.95,0
NEW_RN2483 = smd 1.524 x 1.016: GND 17.78,1.27; GND1 17.78,10.16; GND2 17.78,13.97; GND3 17.78,25.4; GND9 0,25.4; GND10 0,19.05; GND11 0,8.89; GND12 0,1.27; GPIO0 0,16.51; GPIO1 0,15.24; GPIO2 0,13.97; GPIO3 0,12.7; GPIO4 0,11.43; GPIO5 0,10.16; GPIO6 0,6.35; GPIO7 0,5.08; GPIO8 0,3.81; GPIO9 0,2.54; GPIO10 17.78,17.78; GPIO11 17.78,16.51; GPIO12 17.78,12.7; GPIO13 17.78,11.43; P$1 0,21.59; P$2 0,22.86; P$3 0,24.13; P$4 17.78,24.13; P$5 17.78,22.86; P$6 17.78,21.59; P$7 17.78,20.32; P$8 17.78,19.05; P$9 17.78,6.35; P$10 17.78,5.08; P$11 0,7.62; RESET° 0,20.32; UART_CTS 17.78,3.81; UART_RTS 17.78,2.54; UART_RX 17.78,8.89; UART_TX 17.78,7.62; VDD 17.78,15.24; VDD2 0,17.78 | smd 1.016 x 1.524: GND4 12.7,26.67; GND5 11.43,26.67; GND6 8.89,26.67; GND7 6.35,26.67; GND8 5.08,26.67; RFH 10.16,26.67; RFL 7.62,26.67
MICROCHIP_PIC18LF46K22-I-MV_1 = smd 0.7 x 0.2: 1 -2.5,1.8; 2 -2.5,1.4; 3 -2.5,1; 4 -2.5,0.6; 5 -2.5,0.2; 6 -2.5,-0.2; 7 -2.5,-0.6; 8 -2.5,-1; 9 -2.5,-1.4; 10 -2.5,-1.8; 21 2.5,-1.8; 22 2.5,-1.4; 23 2.5,-1; 24 2.5,-0.6; 25 2.5,-0.2; 26 2.5,0.2; 27 2.5,0.6; 28 2.5,1; 29 2.5,1.4; 30 2.5,1.8 | smd 0.2 x 0.7: 11 -1.8,-2.5; 12 -1.4,-2.5; 13 -1,-2.5; 14 -0.6,-2.5; 15 -0.2,-2.5; 16 0.2,-2.5; 17 0.6,-2.5; 18 1,-2.5; 19 1.4,-2.5; 20 1.8,-2.5; 31 1.8,2.5; 32 1.4,2.5; 33 1,2.5; 34 0.6,2.5; 35 0.2,2.5; 36 -0.2,2.5; 37 -0.6,2.5; 38 -1,2.5; 39 -1.4,2.5; 40 -1.8,2.5 | smd 3.7 x 3.7: 41 0,0 | drill 0.2 pad 0.5: PAD_1 1.1,-1.1; PAD_2 0,-1.1; PAD_3 -1.1,-1.1; PAD_4 1.1,0; PAD_5 0,0; PAD_6 -1.1,0; PAD_7 1.1,1.1; PAD_8 0,1.1; PAD_9 -1.1,1.1
CONNECTOR6 = drill 0.8: 1 -0.5,-3.81; 2 -0.5,-7.62; 3 -0.5,-11.43; 4 -0.5,-15.24; 5 -0.5,-19.05; 6 -0.5,-22.86
ICSP = drill 0.6: 1 -0.002,-0.002; 2 -0.002,-2.542; 3 -0.002,-5.082; 4 -0.002,-7.622; 5 -0.002,-10.162
MCP16252 = smd 0.35 x 0.675: 1 -0.95,-1.15; 2 0,-1.15; 3 0.95,-1.15; 4 0.95,1.15; 5 0,1.15; 6 -0.95,1.15
AMD3485E = smd 1.1 x 0.3: 1 -2.6,1.95; 2 -2.6,0.65; 3 -2.6,-0.65; 4 -2.6,-1.95; 5 2.6,-1.95; 6 2.6,-0.65; 7 2.6,0.65; 8 2.6,1.95
SMA_EDGELAUNCH = smd 4.064 x 1.524: GND@1 2.032,-2.54; GND@2 2.032,2.54 | smd 4.064 x 1.524 bottom: GND@3 2.032,2.54; GND@4 2.032,-2.54 | smd 4.064 x 1.27: P 2.032,0

### Placement (x,y rotation side)
C1  31.75,15.24 180 bottom
C2  29.21,22.86 90 bottom
C3  27.43,35.56 90 top
C4  31.75,17.78 180 bottom
C5  26.67,22.86 90 bottom
J1  27.94,8.89 0 bottom
L1  38.1,16.51 270 bottom
L1-R  6.35,3.81 180 top
L2-G  10.16,3.81 180 top
R1  6.35,7.62 270 top
R2  10.16,7.62 270 top
R3  22.86,20.32 90 bottom
R4  20.32,20.32 270 bottom
R5  17.27,71.12 90 top
R6  52.07,24.13 270 top
R7  14.22,57.4 90 bottom
R8  14.22,44.7 270 bottom
R9  14.22,50.8 270 bottom
RN1  21.59,40.64 0 top
U1  34.29,35.56 0 top
U$1  3.81,36.83 0 top
U$2  58.42,15.24 0 top
U$3  7.62,72.39 0 top
U$4  26.67,16.51 0 bottom
U$5  29.21,52.07 90 bottom
X1  31.75,78.74 270 top

### Tracks (layer width: path | path; a pad name or v marks a point on that pad's centre or on a via)
DE  (via drill 0.25)
  Top 0.203: U1.18 35.29,31.51 36.32,30.48 v36.58,30.48
  Bottom 0.203: v36.58,30.48 38.36,30.48 40.13,32.26 40.13,36.07 28.56,47.64 U$5.3
DI  (via drill 0.51)
  Top 0.203: U1.4 31.15,36.16 27.18,40.13 v27.18,45.47
  Bottom 0.203: v27.18,45.47 27.18,49.39 U$5.4
EXT1  (via drill 0.25)
  Top 0.203: U1.19 35.69,32.13 35.81,32 v36.26,32
  Bottom 0.203: v36.26,32 36,31.75 17.28,31.75 U$1.5
EXT2  (via drill 0.25)
  Top 0.203: U1.20 37.59,31.56 v37.59,31.24
  Bottom 0.203: v37.59,31.24 20.58,31.24 U$1.6
GND  (via drill 0.51)
  Top 0.203: v26.67,14.48 17.53,14.48 v15.75,16.26 | C3.2 28.43,35.36 U1.6 34.09,35.36 U1.41 34.89,36.16 U1.27
  Bottom 0.203: U$4.2 v26.67,14.48 | v15.75,16.26 15.75,19.3 17.5,21.06 R4.1
  other vias: 54.61,61.72 54.61,59.69 54.61,57.66 3.81,57.4 3.81,55.12
  pour Bottom: -8.89,85.09 70.61,85.09 74.93,80.77 74.93,-13.21 70.36,-8.64 -7.62,-8.64 -8.64,-7.62 -8.64,84.58 -8.64,84.84
  pour Top: -11.68,92.46 79.25,92.46 82.55,89.15 82.55,-19.3 87.88,-24.64 -10.16,-24.64 -24.13,-10.67 -24.13,80.01
MCLR
  Top 0.203: U1.16 34.49,30.28 41.4,23.37 47.75,23.37 47.79,23.33 R6.2 58.42,16.98 U$2.1
N$1  (via drill 0.51)
  Top 0.203: U1.29 37.47,36.96 39.37,38.86 v43.94,38.86 | v12.45,10.41 11.18,10.41 10.16,9.4 R2.1
  Bottom 0.203: v43.94,38.86 48.51,38.86 50.04,37.34 50.04,7.11 46.48,3.56 19.3,3.56 13.59,9.27 13.46,9.4 v12.45,10.41
N$2
  Top 0.203: R2.2 L2-G.A
N$3  (via drill 0.51)
  Top 0.203: U1.28 36.81,36.58 37.85,36.58 39.62,38.35 41.4,38.35 v41.66,38.1 | v8.89,12.19 6.35,9.65 R1.1
  Bottom 0.203: v41.66,38.1 46.99,38.1 48.26,36.83 48.26,9.4 43.69,4.83 20.57,4.83 12.95,12.45 9.14,12.45 v8.89,12.19
N$4
  Bottom 0.203: U$4.6 27.74,17.78 C4.1 31.15,17.58 C1.1 | U$4.3 25.72,13.65
  Bottom 0.305: J1.2 24.94,9.7 27.3,12.06 | C1.1 30.48,15.24 27.3,12.06 | 25.72,13.65 27.3,12.06 | L1.1 35.44,20.32 33.49,20.32 C4.1
N$5
  Top 0.203: R1.2 L1-R.A
N$6  (via drill 0.51)
  Top 0.305: v27.94,13.97 29.21,12.7 v35.56,12.7
  Bottom 0.305: U$4.1 27.62,14.29 v27.94,13.97 | v35.56,12.7 38.1,15.24 L1.2
N$7
  Top 0.203: R5.2 22.31,71.92 24.38,69.85 24.38,62.74 22.61,60.96 RN1.RESET°
  Top 0.305: R5.2 16.8,72.39 U$3.1
N$8
  Top 0.762: X1.P RN1.RFH
N$9
  Bottom 0.203: R3.1 24.87,19.58 25.72,18.73 U$4.4
  Bottom 0.305: R3.1 R4.2
N$10  (via drill 0.51)
  Top 0.203: RN1.P$2 v18.54,63.5
  Bottom 0.203: v18.54,63.5 17.27,62.23 U$3.5
N$12  (via drill 0.51)
  Top 0.203: RN1.P$1 17.78,62.23 v15.24,64.77
  Bottom 0.203: v15.24,64.77 U$3.4
N$13
  Bottom 0.203: U$5.7 29.86,52.97 28.7,51.82 18.54,51.82 16.51,49.78 14.29,49.78 R9.2 R8.1 10.92,45.65 9.4,44.13 9.4,31.49 U$1.3
N$14
  Bottom 0.203: U$5.6 28.56,55.01 26.92,56.64 14.41,56.64 R7.1 R9.1 7.81,51.75 1.27,45.21 1.27,23.63 U$1.4
PGC
  Top 0.203: U1.14 33.69,26.76 55.37,5.08 U$2.5
PGD
  Top 0.203: U1.15 34.09,28.65 55.12,7.62 U$2.4
RE  (via drill 0.25)
  Top 0.203: U1.17 34.89,30.64 35.87,29.67 v37.78,29.67
  Bottom 0.203: v37.78,29.67 38.35,29.67 40.79,32.11 40.79,36.42 29.86,47.36 U$5.2
RO  (via drill 0.25, 0.51)
  Top 0.203: v31.24,47.5 30.48,46.74 v30.48,41.4 | U1.5 30.28,35.76 v29.72,36.32
  Bottom 0.203: v30.48,41.4 29.72,40.64 v29.72,36.32 | v31.24,47.5 31.16,47.58 U$5.1
RX
  Top 0.203: U1.1 31.79,39.66 33.02,40.89 41.91,40.89 43.94,42.93 43.94,46.99 42.67,48.26 RN1.UART_TX
TX
  Top 0.203: U1.40 32.49,39.09 33.53,40.13 42.67,40.13 44.96,42.42 44.96,46.99 42.42,49.53 RN1.UART_RX
VDD  (via drill 0.51)
  Top 0.203: U1.26 37.59,35.76 | 37.59,35.76 42.98,35.76 52.07,26.67 R6.1 59.69,17.31 59.69,13.97 U$2.2 | v29.21,25.4 27.43,27.18 C3.1 29.17,34.76 29.21,34.8 | v38.1,34.04 38.1,35.25 37.59,35.76 | 37.59,35.76 38.41,36.58 43.18,36.58 47.24,40.64 47.24,52.07 43.43,55.88 RN1.VDD 36.32,55.88 | 36.32,55.88 v34.29,55.88 | 36.32,55.88 33.78,58.42 RN1.VDD2 19.81,58.42 | v17.02,58.42 19.81,58.42 | 8.42,69.85 8.42,69.81 19.81,58.42 | U1.7 29.37,34.96 29.21,34.8 | 29.21,34.8 30.23,33.78 v30.48,33.78
  Top 0.305: R5.1 16.8,69.85 8.42,69.85 U$3.2
  Bottom 0.203: C2.2 v29.21,25.4 | v30.48,33.78 30.5,33.8 37.87,33.8 v38.1,34.04 | v34.29,55.88 32.37,55.88 U$5.8 | R7.2 16.95,58.35 v17.02,58.42
  Bottom 0.305: U$4.5 C5.1 | C5.1 25.67,21.06 R3.2 | C5.1 28.17,23.56 C2.2
WAKE  (via drill 0.51)
  Top 0.203: U1.32 35.69,38.99 v35.56,39.12 | v24.38,43.18 RN1.GPIO9
  Bottom 0.203: v35.56,39.12 31.5,43.18 v24.38,43.18